# EAGLE design CKR_BM_v4.2_TR (EAGLE 9.5.2)

## Sheet 1 of 3: OTHER_1
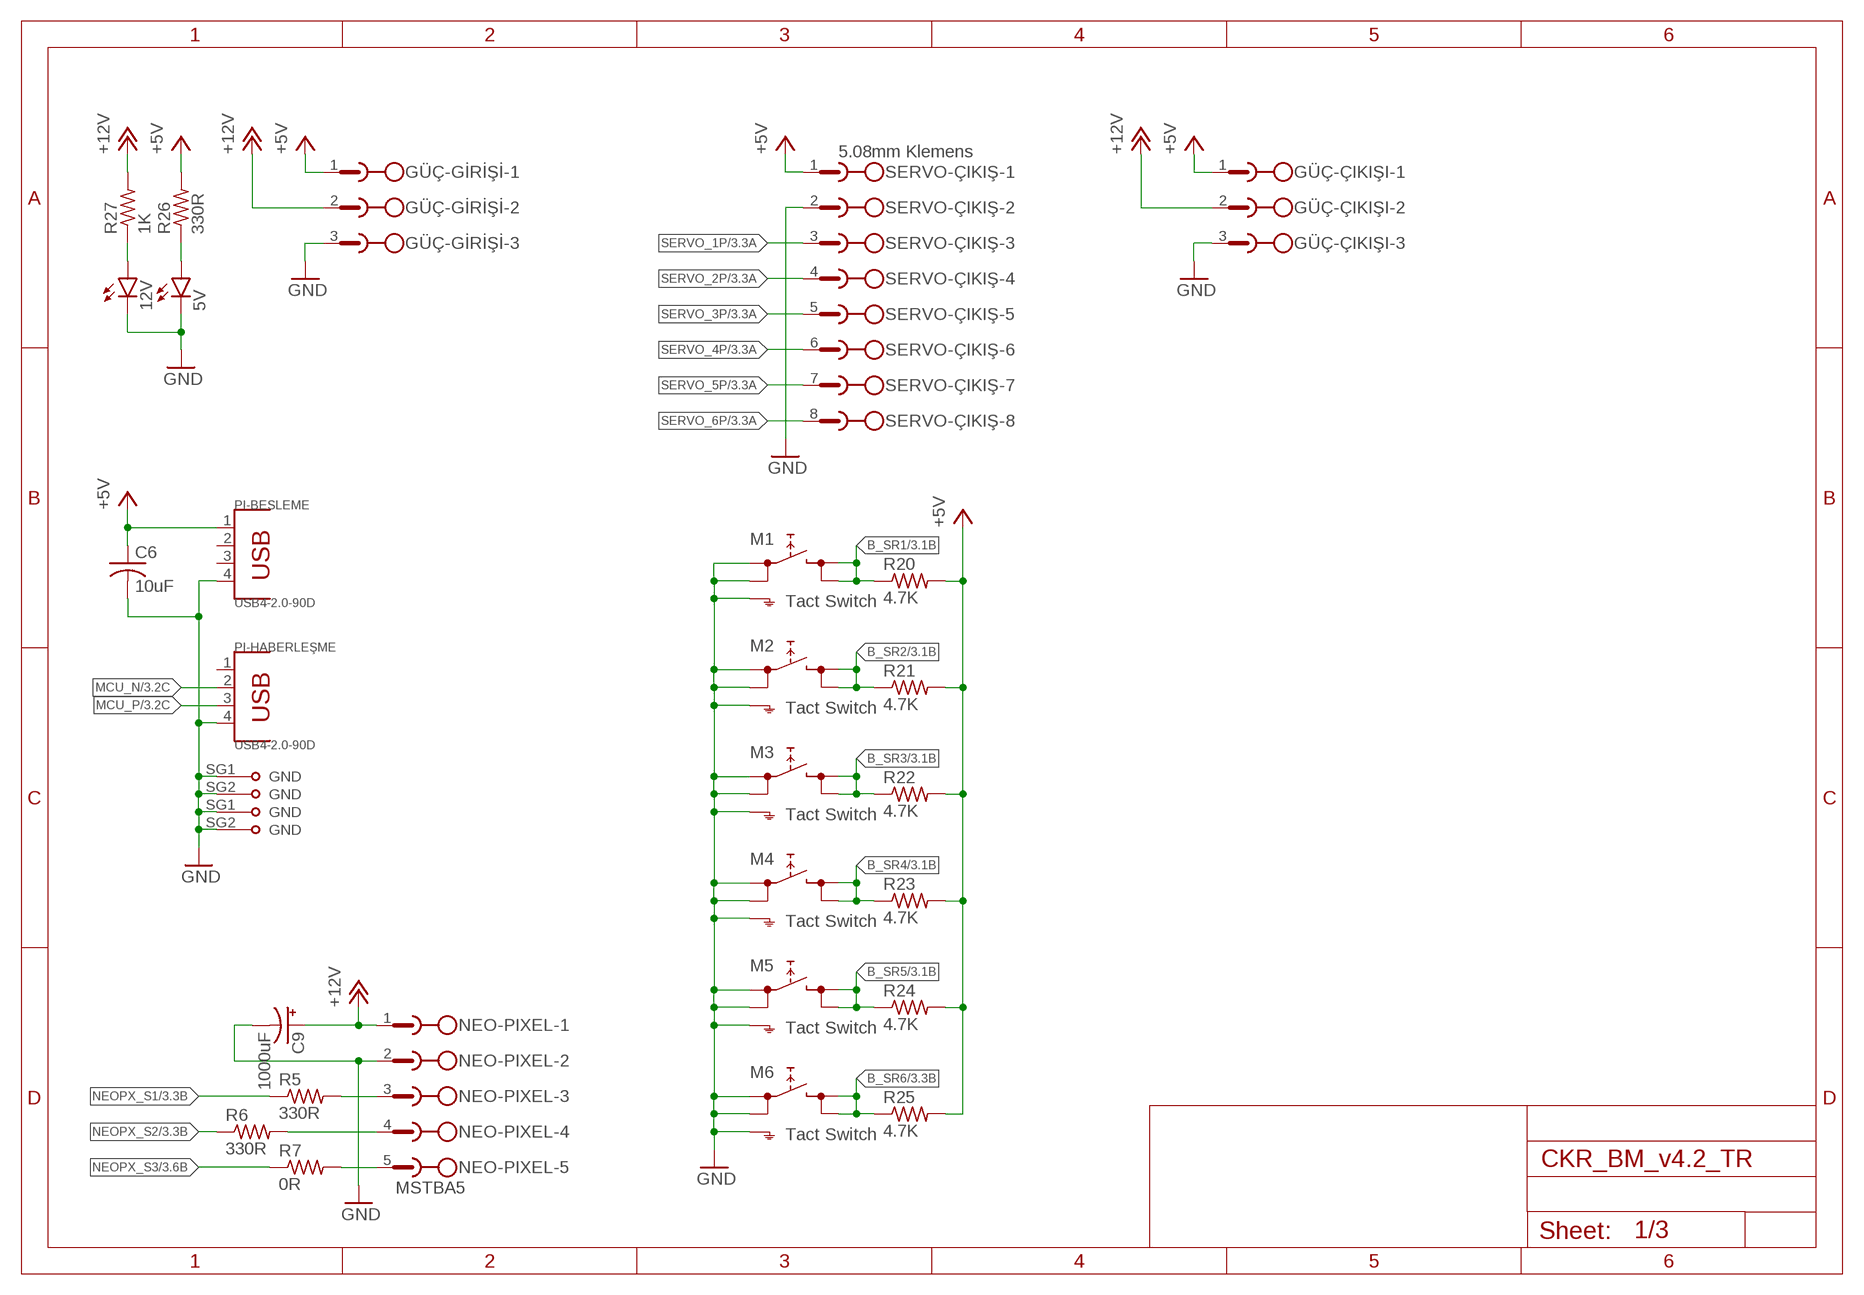
[diagram p0: schematic, sheet 1]

### Parts
5V  LEDCHIP-LED0805  [CHIP-LED0805]
12V  LEDCHIP-LED0805  [CHIP-LED0805]
C6  10uF  C-USC0805  [C0805]
C9  1000uF  CPOL-US140CLH-1010  [140CLH-1010]
GÜÇ-GİRİŞİ  5.08mm Klemens  MSTBA3  [MSTBA3]
GÜÇ-ÇIKIŞI  5.08mm Klemens  MSTBA3  [MSTBA3]
M1  Tact Switch  SKHMPSE010  [SKHMPXE010]
M2  Tact Switch  SKHMPSE010  [SKHMPXE010]
M3  Tact Switch  SKHMPSE010  [SKHMPXE010]
M4  Tact Switch  SKHMPSE010  [SKHMPXE010]
M5  Tact Switch  SKHMPSE010  [SKHMPXE010]
M6  Tact Switch  SKHMPSE010  [SKHMPXE010]
NEO-PIXEL  MSTBA5  [MSTBA5]
PI-BESLEME  USB4-2.0-90D  DIP-USB-A-TYPE-FMAL(4+2P-2.0-90D)  [USB4+2P-2.0-90D]
PI-HABERLEŞME  USB4-2.0-90D  DIP-USB-A-TYPE-FMAL(4+2P-2.0-90D)  [USB4+2P-2.0-90D]
R5  330R  R-US_R0805  [R0805]
R6  330R  R-US_R0805  [R0805]
R7  0R  R-US_R0805  [R0805]
R20  4.7K  R-US_R0805  [R0805]
R21  4.7K  R-US_R0805  [R0805]
R22  4.7K  R-US_R0805  [R0805]
R23  4.7K  R-US_R0805  [R0805]
R24  4.7K  R-US_R0805  [R0805]
R25  4.7K  R-US_R0805  [R0805]
R26  330R  R-US_R0805  [R0805]
R27  1K  R-US_R0805  [R0805]
SERVO-ÇIKIŞ  5.08mm Klemens  MSTBA8  [MSTBA8]

### Nets
+5V: C6.1 GÜÇ-GİRİŞİ.1 GÜÇ-ÇIKIŞI.1 PI-BESLEME.1 R20.2 R21.2 R22.2 R23.2 R24.2 R25.2 R26.2 SERVO-ÇIKIŞ.1 ; also sheet 2,3
+12V: C9.+ GÜÇ-GİRİŞİ.2 GÜÇ-ÇIKIŞI.2 NEO-PIXEL.1 R27.2 ; also sheet 2
B_SR1: M1.3(2.1) M1.4(2.2) R20.1 ; also sheet 3
B_SR2: M2.3(2.1) M2.4(2.2) R21.1 ; also sheet 3
B_SR3: M3.3(2.1) M3.4(2.2) R22.1 ; also sheet 3
B_SR4: M4.3(2.1) M4.4(2.2) R23.1 ; also sheet 3
B_SR5: M5.3(2.1) M5.4(2.2) R24.1 ; also sheet 3
B_SR6: M6.3(2.1) M6.4(2.2) R25.1 ; also sheet 3
GND: 5V.C 12V.C C6.2 C9.- GÜÇ-GİRİŞİ.3 GÜÇ-ÇIKIŞI.3 M1.1(1.1) M1.2(1.2) M1.5(SH) M2.1(1.1) M2.2(1.2) M2.5(SH) M3.1(1.1) M3.2(1.2) M3.5(SH) M4.1(1.1) M4.2(1.2) M4.5(SH) M5.1(1.1) M5.2(1.2) M5.5(SH) M6.1(1.1) M6.2(1.2) M6.5(SH) NEO-PIXEL.2 PI-BESLEME.4 PI-BESLEME.SG1(GND) PI-BESLEME.SG2(GND) PI-HABERLEŞME.4 PI-HABERLEŞME.SG1(GND) PI-HABERLEŞME.SG2(GND) SERVO-ÇIKIŞ.2 ; also sheet 2,3
MCU_N [diff pairs]: PI-HABERLEŞME.2 ; also sheet 3
MCU_P [diff pairs]: PI-HABERLEŞME.3 ; also sheet 3
N$1: NEO-PIXEL.3 R5.2
N$2: NEO-PIXEL.4 R6.2
N$3: NEO-PIXEL.5 R7.2
N$17: 5V.A R26.1
N$19: 12V.A R27.1
NEOPX_S1: R5.1 ; also sheet 3
NEOPX_S2: R6.1 ; also sheet 3
NEOPX_S3: R7.1 ; also sheet 3
SERVO_1P: SERVO-ÇIKIŞ.3 ; also sheet 3
SERVO_2P: SERVO-ÇIKIŞ.4 ; also sheet 3
SERVO_3P: SERVO-ÇIKIŞ.5 ; also sheet 3
SERVO_4P: SERVO-ÇIKIŞ.6 ; also sheet 3
SERVO_5P: SERVO-ÇIKIŞ.7 ; also sheet 3
SERVO_6P: SERVO-ÇIKIŞ.8 ; also sheet 3
Unconnected: PI-BESLEME.2 PI-BESLEME.3 PI-HABERLEŞME.1

## Sheet 2 of 3: OTHER_2
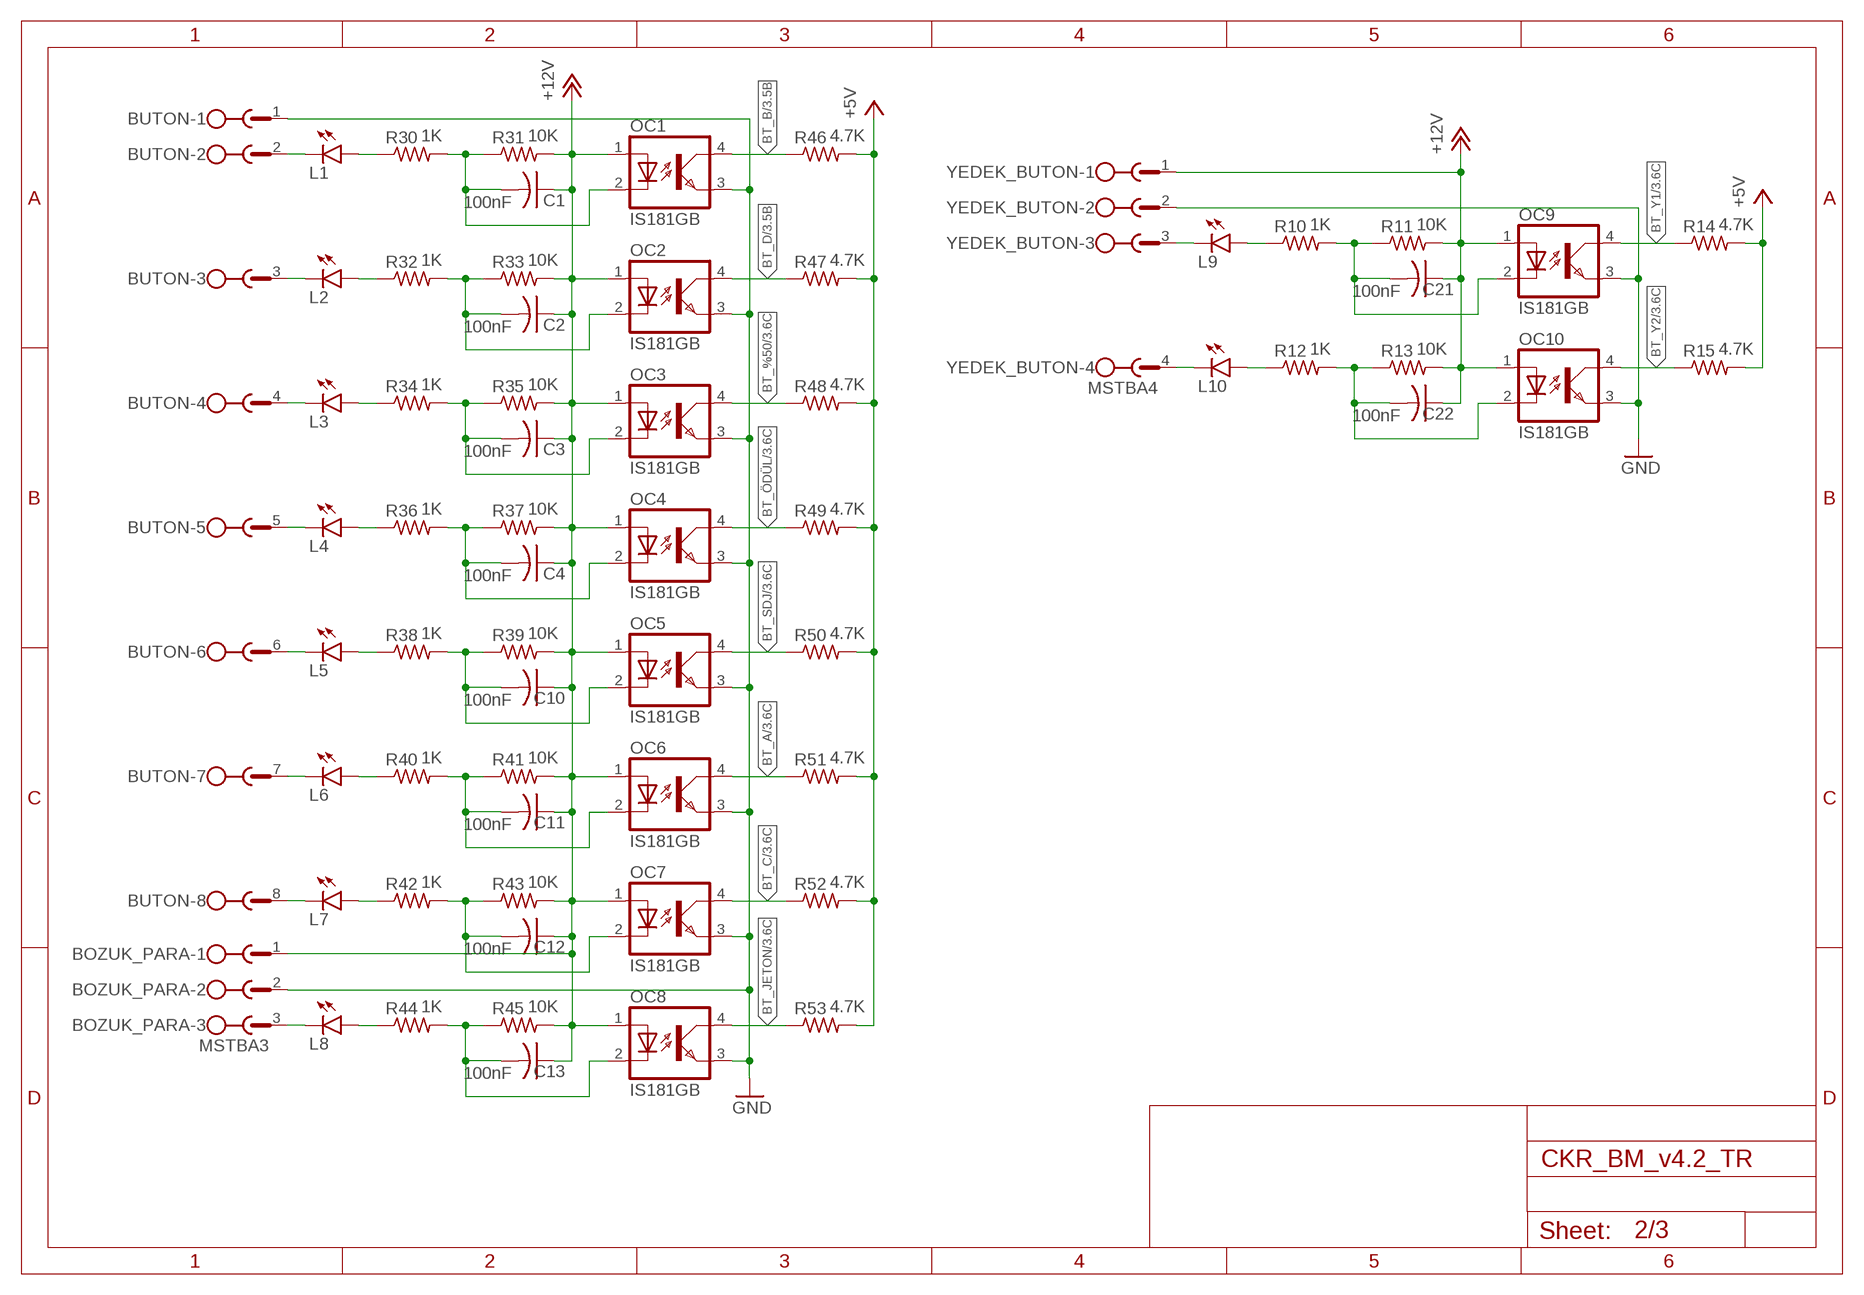
[diagram p1: schematic, sheet 2]

### Parts
BOZUK_PARA  MSTBA3  [MSTBA3]
BUTON  MSTBA8  [MSTBA8]
C1  100nF  C-USC0805  [C0805]
C2  100nF  C-USC0805  [C0805]
C3  100nF  C-USC0805  [C0805]
C4  100nF  C-USC0805  [C0805]
C10  100nF  C-USC0805  [C0805]
C11  100nF  C-USC0805  [C0805]
C12  100nF  C-USC0805  [C0805]
C13  100nF  C-USC0805  [C0805]
C21  100nF  C-USC0805  [C0805]
C22  100nF  C-USC0805  [C0805]
L1  LEDCHIP-LED0805  [CHIP-LED0805]
L2  LEDCHIP-LED0805  [CHIP-LED0805]
L3  LEDCHIP-LED0805  [CHIP-LED0805]
L4  LEDCHIP-LED0805  [CHIP-LED0805]
L5  LEDCHIP-LED0805  [CHIP-LED0805]
L6  LEDCHIP-LED0805  [CHIP-LED0805]
L7  LEDCHIP-LED0805  [CHIP-LED0805]
L8  LEDCHIP-LED0805  [CHIP-LED0805]
L9  LEDCHIP-LED0805  [CHIP-LED0805]
L10  LEDCHIP-LED0805  [CHIP-LED0805]
OC1  IS181GB  TLP181  [SO-4]
OC2  IS181GB  TLP181  [SO-4]
OC3  IS181GB  TLP181  [SO-4]
OC4  IS181GB  TLP181  [SO-4]
OC5  IS181GB  TLP181  [SO-4]
OC6  IS181GB  TLP181  [SO-4]
OC7  IS181GB  TLP181  [SO-4]
OC8  IS181GB  TLP181  [SO-4]
OC9  IS181GB  TLP181  [SO-4]
OC10  IS181GB  TLP181  [SO-4]
R10  1K  R-US_R0805  [R0805]
R11  10K  R-US_R0805  [R0805]
R12  1K  R-US_R0805  [R0805]
R13  10K  R-US_R0805  [R0805]
R14  4.7K  R-US_R0805  [R0805]
R15  4.7K  R-US_R0805  [R0805]
R30  1K  R-US_R0805  [R0805]
R31  10K  R-US_R0805  [R0805]
R32  1K  R-US_R0805  [R0805]
R33  10K  R-US_R0805  [R0805]
R34  1K  R-US_R0805  [R0805]
R35  10K  R-US_R0805  [R0805]
R36  1K  R-US_R0805  [R0805]
R37  10K  R-US_R0805  [R0805]
R38  1K  R-US_R0805  [R0805]
R39  10K  R-US_R0805  [R0805]
R40  1K  R-US_R0805  [R0805]
R41  10K  R-US_R0805  [R0805]
R42  1K  R-US_R0805  [R0805]
R43  10K  R-US_R0805  [R0805]
R44  1K  R-US_R0805  [R0805]
R45  10K  R-US_R0805  [R0805]
R46  4.7K  R-US_R0805  [R0805]
R47  4.7K  R-US_R0805  [R0805]
R48  4.7K  R-US_R0805  [R0805]
R49  4.7K  R-US_R0805  [R0805]
R50  4.7K  R-US_R0805  [R0805]
R51  4.7K  R-US_R0805  [R0805]
R52  4.7K  R-US_R0805  [R0805]
R53  4.7K  R-US_R0805  [R0805]
YEDEK_BUTON  MSTBA4  [MSTBA4]

### Nets
+5V: R14.2 R15.2 R46.2 R47.2 R48.2 R49.2 R50.2 R51.2 R52.2 R53.2 ; also sheet 1,3
+12V: BOZUK_PARA.1 C1.1 C2.1 C3.1 C4.1 C10.1 C11.1 C12.1 C13.1 C21.1 C22.1 OC1.1(A) OC2.1(A) OC3.1(A) OC4.1(A) OC5.1(A) OC6.1(A) OC7.1(A) OC8.1(A) OC9.1(A) OC10.1(A) R11.2 R13.2 R31.2 R33.2 R35.2 R37.2 R39.2 R41.2 R43.2 R45.2 YEDEK_BUTON.1 ; also sheet 1
BT_%50: OC3.4(COL) R48.1 ; also sheet 3
BT_A: OC6.4(COL) R51.1 ; also sheet 3
BT_B: OC1.4(COL) R46.1 ; also sheet 3
BT_C: OC7.4(COL) R52.1 ; also sheet 3
BT_D: OC2.4(COL) R47.1 ; also sheet 3
BT_JETON: OC8.4(COL) R53.1 ; also sheet 3
BT_SDJ: OC5.4(COL) R50.1 ; also sheet 3
BT_Y1: OC9.4(COL) R14.1 ; also sheet 3
BT_Y2: OC10.4(COL) R15.1 ; also sheet 3
BT_ÖDÜL: OC4.4(COL) R49.1 ; also sheet 3
GND: BOZUK_PARA.2 BUTON.1 OC1.3(EMIT) OC2.3(EMIT) OC3.3(EMIT) OC4.3(EMIT) OC5.3(EMIT) OC6.3(EMIT) OC7.3(EMIT) OC8.3(EMIT) OC9.3(EMIT) OC10.3(EMIT) YEDEK_BUTON.2 ; also sheet 1,3
N$4: L1.A R30.1
N$5: C1.2 OC1.2(C) R30.2 R31.1
N$6: L9.A R10.1
N$7: BUTON.2 L1.C
N$11: BOZUK_PARA.3 L8.C
N$12: L2.A R32.1
N$13: C2.2 OC2.2(C) R32.2 R33.1
N$14: C21.2 OC9.2(C) R10.2 R11.1
N$24: BUTON.8 L7.C
N$25: L3.A R34.1
N$26: C3.2 OC3.2(C) R34.2 R35.1
N$27: L9.C YEDEK_BUTON.3
N$28: BUTON.7 L6.C
N$29: L4.A R36.1
N$30: C4.2 OC4.2(C) R36.2 R37.1
N$31: L10.A R12.1
N$32: BUTON.6 L5.C
N$33: L5.A R38.1
N$34: C10.2 OC5.2(C) R38.2 R39.1
N$35: C22.2 OC10.2(C) R12.2 R13.1
N$36: BUTON.5 L4.C
N$37: L6.A R40.1
N$38: C11.2 OC6.2(C) R40.2 R41.1
N$39: L10.C YEDEK_BUTON.4
N$40: BUTON.4 L3.C
N$41: L7.A R42.1
N$42: C12.2 OC7.2(C) R42.2 R43.1
N$44: BUTON.3 L2.C
N$45: L8.A R44.1
N$46: C13.2 OC8.2(C) R44.2 R45.1

## Sheet 3 of 3: IC
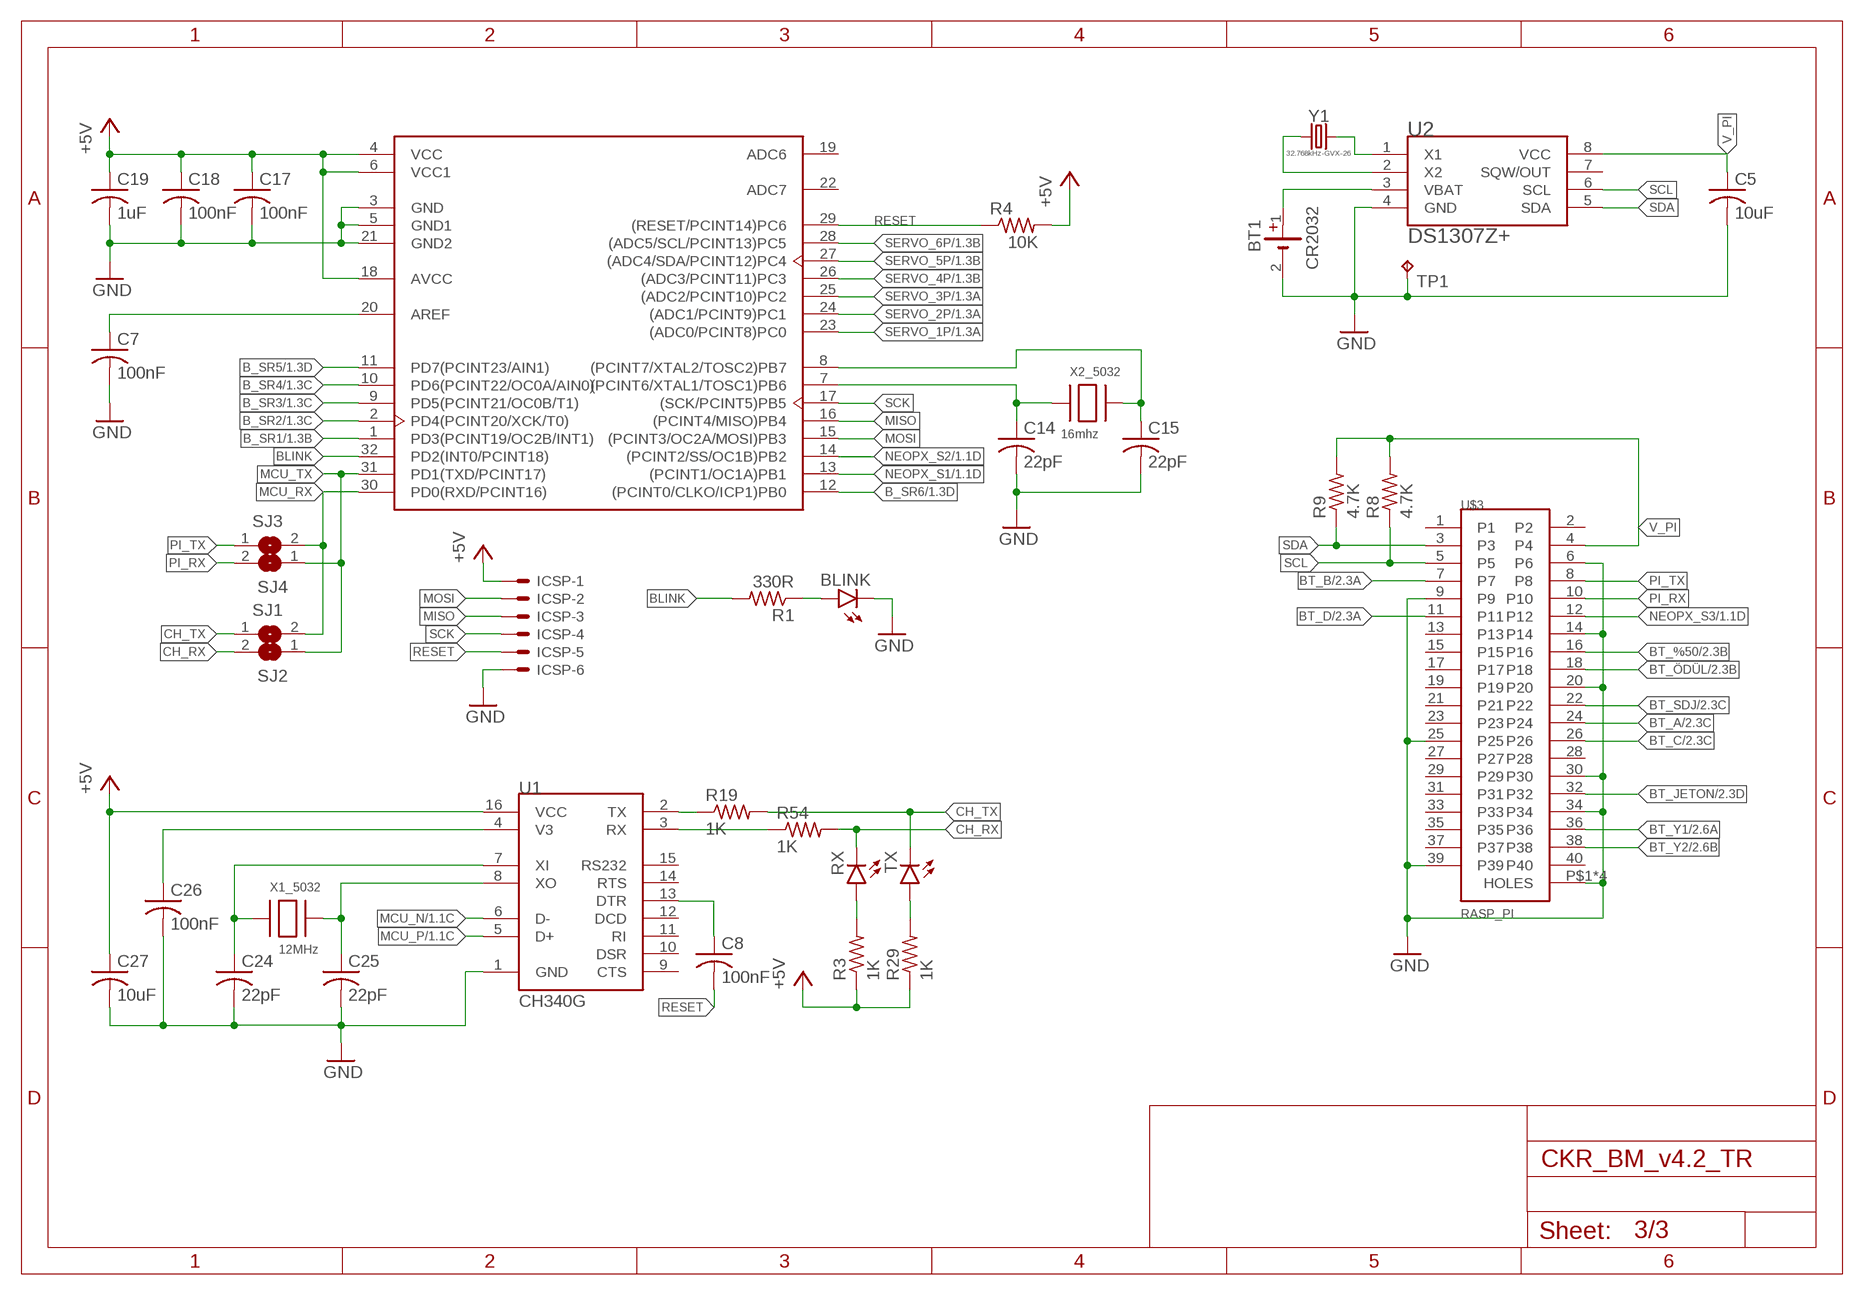
[diagram p2: schematic, sheet 3]

### Parts
BLINK  LEDCHIP-LED0805  [CHIP-LED0805]
BT1  CR2032  79528211  [79528211]
C5  10uF  C-USC0805  [C0805]
C7  100nF  C-USC0805  [C0805]
C8  100nF  C-USC0805  [C0805]
C14  22pF  C-USC0805  [C0805]
C15  22pF  C-USC0805  [C0805]
C17  100nF  C-USC0805  [C0805]
C18  100nF  C-USC0805  [C0805]
C19  1uF  C-USC0805  [C0805]
C24  22pF  C-USC0805  [C0805]
C25  22pF  C-USC0805  [C0805]
C26  100nF  C-USC0805  [C0805]
C27  10uF  C-USC0805  [C0805]
ICSP  C-GRID-06-70543  [70543-06]
R1  330R  R-US_R0805  [R0805]
R3  1K  R-US_R0805  [R0805]
R4  10K  R-US_R0805  [R0805]
R8  4.7K  R-US_R0805  [R0805]
R9  4.7K  R-US_R0805  [R0805]
R19  1K  R-US_R0805  [R0805]
R29  1K  R-US_R0805  [R0805]
R54  1K  R-US_R0805  [R0805]
RX  LEDCHIP-LED0805  [CHIP-LED0805]
SJ1  SJ  [SJ]
SJ2  SJ  [SJ]
SJ3  SJ  [SJ]
SJ4  SJ  [SJ]
TP1  GND  TPTP15R  [TP15R]
TX  LEDCHIP-LED0805  [CHIP-LED0805]
U1  CH340G  [SOIC16]
U2  DS1307Z+  [SOIC-8N]
U4  ATMEGA328P-AU  [TQFP-32]
U$3  RASP_PI  [RASP_PI]
X1_5032  12MHz  XTALNX5032  [NX5032]
X2_5032  16mhz  XTALNX5032  [NX5032]
Y1  32.768kHz-GVX-26  CRYSTAL-32.768KHZPTH-2X6  [CRYSTAL-PTH-2X6-CYL]

### Nets
+5V: C17.1 C18.1 C19.1 C27.1 ICSP.1 R3.1 R4.2 R29.1 U1.16(VCC) U4.4(VCC) U4.6(VCC1) U4.18(AVCC) ; also sheet 1,2
B_SR1: U4.1(PD3(PCINT19/OC2B/INT1)) ; also sheet 1
B_SR2: U4.2(PD4(PCINT20/XCK/T0)) ; also sheet 1
B_SR3: U4.9(PD5(PCINT21/OC0B/T1)) ; also sheet 1
B_SR4: U4.10(PD6(PCINT22/OC0A/AIN0)) ; also sheet 1
B_SR5: U4.11(PD7(PCINT23/AIN1)) ; also sheet 1
B_SR6: U4.12((PCINT0/CLKO/ICP1)PB0) ; also sheet 1
BLINK: R1.2 U4.32(PD2(INT0/PCINT18))
BT_%50: U$3.16 ; also sheet 2
BT_A: U$3.24 ; also sheet 2
BT_B: U$3.7 ; also sheet 2
BT_C: U$3.26 ; also sheet 2
BT_D: U$3.11 ; also sheet 2
BT_JETON: U$3.32 ; also sheet 2
BT_SDJ: U$3.22 ; also sheet 2
BT_Y1: U$3.36 ; also sheet 2
BT_Y2: U$3.38 ; also sheet 2
BT_ÖDÜL: U$3.18 ; also sheet 2
CH_RX: R54.2 RX.C SJ2.2
CH_TX: R19.2 SJ1.1 TX.C
GND: BLINK.C BT1.2(-) C5.2 C7.2 C14.2 C15.2 C17.2 C18.2 C19.2 C24.2 C25.2 C26.2 C27.2 ICSP.6 TP1.TP U1.1(GND) U2.4(GND) U4.3(GND) U4.5(GND1) U4.21(GND2) U$3.6 U$3.9 U$3.14 U$3.20 U$3.25 U$3.30 U$3.34 U$3.39 U$3.P$1(HOLES) U$3.P$2(HOLES) U$3.P$3(HOLES) U$3.P$4(HOLES) ; also sheet 1,2
MCU_N [diff pairs]: U1.6(D-) ; also sheet 1
MCU_P [diff pairs]: U1.5(D+) ; also sheet 1
MCU_RX: SJ1.2 SJ3.2 U4.30(PD0(RXD/PCINT16))
MCU_TX: SJ2.1 SJ4.1 U4.31(PD1(TXD/PCINT17))
MISO: ICSP.3 U4.16((PCINT4/MISO)PB4)
MOSI: ICSP.2 U4.15((PCINT3/OC2A/MOSI)PB3)
N$8: BT1.1(+) U2.3(VBAT)
N$9: U2.2(X2) Y1.1
N$10: U2.1(X1) Y1.2
N$15: R3.2 RX.A
N$16: R29.2 TX.A
N$20: C14.1 U4.7((PCINT6/XTAL1/TOSC1)PB6) X2_5032.P$1
N$21: C8.1 U1.13(DTR)
N$22: C26.1 U1.4(V3)
N$49: C24.1 U1.7(XI) X1_5032.P$1
N$50: C25.1 U1.8(XO) X1_5032.P$2
N$52: R19.1 U1.2(TX)
N$53: R54.1 U1.3(RX)
N$55: BLINK.A R1.1
N$58: C7.1 U4.20(AREF)
N$78: C15.1 U4.8((PCINT7/XTAL2/TOSC2)PB7) X2_5032.P$2
NEOPX_S1: U4.13((PCINT1/OC1A)PB1) ; also sheet 1
NEOPX_S2: U4.14((PCINT2/SS/OC1B)PB2) ; also sheet 1
NEOPX_S3: U$3.12 ; also sheet 1
PI_RX: SJ4.2 U$3.10
PI_TX: SJ3.1 U$3.8
RESET: C8.2 ICSP.5 R4.1 U4.29((RESET/PCINT14)PC6)
SCK: ICSP.4 U4.17((SCK/PCINT5)PB5)
SCL: R8.1 U2.6(SCL) U$3.5
SDA: R9.1 U2.5(SDA) U$3.3
SERVO_1P: U4.23((ADC0/PCINT8)PC0) ; also sheet 1
SERVO_2P: U4.24((ADC1/PCINT9)PC1) ; also sheet 1
SERVO_3P: U4.25((ADC2/PCINT10)PC2) ; also sheet 1
SERVO_4P: U4.26((ADC3/PCINT11)PC3) ; also sheet 1
SERVO_5P: U4.27((ADC4/SDA/PCINT12)PC4) ; also sheet 1
SERVO_6P: U4.28((ADC5/SCL/PCINT13)PC5) ; also sheet 1
V_PI: C5.1 R8.2 R9.2 U2.8(VCC) U$3.4
Unconnected: U1.9(CTS) U1.10(DSR) U1.11(RI) U1.12(DCD) U1.14(RTS) U1.15(RS232) U2.7(SQW/OUT) U4.19(ADC6) U4.22(ADC7) U$3.1 U$3.2 U$3.13 U$3.15 U$3.17 U$3.19 U$3.21 U$3.23 U$3.27 U$3.28 U$3.29 U$3.31 U$3.33 U$3.35 U$3.37 U$3.40

## Library data of the parts
5V 12V BLINK L1-L10 RX TX = led:LED: LED OSRAM: - CHIPLED LG R971, LG N971, LY N971, LG Q971, LY Q971, LO R971, LY R971 LH N974, LH R974 LS Q976, LO Q976, LY Q976 LO Q996 - Hyper CHIPLED LW Q18S LB Q993, LB Q99A, LB R99A - SideLED LS A670, LO A670, LY A670, LG A670, LP A670 LB A673, LV A673, LT A673, LW A673 LH A674 LY A675 LS A676, LA A676, LO A676, LY A676, LW A676 LS A679, LY A679, LG A679 - Hyper Micro SIDELED® LS Y876, LA Y876, LO Y876, LY Y876 LT Y87S - SmartLED LW L88C, LW L88S LB L89C, LB L89S, LG L890 LS L89K, LO L89K, LY L89K LS L896, LA L896, LO L896, LY L896 - TOPLED LS T670, LO T670, LY T670, LG T670, LP T670 LSG T670, LSP T670, LSY T670, LOP T670, LYG T670 LG T671, LOG T671, LSG T671 LB T673, LV T673, LT T673, LW T673 LH T674 LS T676, LA T676, LO T676, LY T676, LB T676, LH T676, LSB T676, LW T676 LB T67C, LV T67C, LT T67C, LS T67K, LO T67K, LY T67K, LW E67C LS E67B, LA E67B, LO E67B, LY E67B, LB E67C, LV E67C, LT E67C LW T67C LS T679, LY T679, LG T679 LS T770, LO T770, LY T770, LG T770, LP T770 LB T773, LV T773, LT T773, LW T773 LH T774 LS E675, LA E675, LY E675, LS T675 LS T776, LA T776, LO T776, LY T776, LB T776 LHGB T686 LT T68C, LB T68C - Hyper Mini TOPLED® LB M676 - Mini TOPLED Santana® LG M470 LS M47K, LO M47K, LY M47K Source: http://www.osram.convergy.de LUXEON: - LUMILED® LXK2-PW12-R00, LXK2-PW12-S00, LXK2-PW14-U00, LXK2-PW14-V00 LXK2-PM12-R00, LXK2-PM12-S00, LXK2-PM14-U00 LXK2-PE12-Q00, LXK2-PE12-R00, LXK2-PE12-S00, LXK2-PE14-T00, LXK2-PE14-U00 LXK2-PB12-K00, LXK2-PB12-L00, LXK2-PB12-M00, LXK2-PB14-N00, LXK2-PB14-P00, LXK2-PB14-Q00 LXK2-PR12-L00, LXK2-PR12-M00, LXK2-PR14-Q00, LXK2-PR14-R00 LXK2-PD12-Q00, LXK2-PD12-R00, LXK2-PD12-S00 LXK2-PH12-R00, LXK2-PH12-S00 LXK2-PL12-P00, LXK2-PL12-Q00, LXK2-PL12-R00 Source: www.luxeon.com KINGBRIGHT: KA-3528ASYC Source: www.kingbright.com
BOZUK_PARA GÜÇ-GİRİŞİ GÜÇ-ÇIKIŞI = con-phoenix-508:MSTBA3: PHOENIX; MF: FARNELL; MPN: 1757255; OC_FARNELL: 3705183; OC_NEWARK: 71C4162
BT1 = Battery Holder:79528211: BATTERY HOLDER COIN 20MM PC PIN Manufacturer's datasheet <https://katalog.we-online.de/em/datasheet/79528211.pdf>; CREATED_BY: PCBLayout.com; DIGIKEY_PART_NO: 732-12326-ND; MANUFACTURER: Wurth Electronics Inc.; MPN: 79528211
BUTON SERVO-ÇIKIŞ = con-phoenix-508:MSTBA8: PHOENIX; MF: FARNELL; MPN: 1757307; OC_FARNELL: 3705225; OC_NEWARK: 71C4166
C1-C8 C10-C15 C17-C19 C21 C22 C24-C27 = rcl:C-US: CAPACITOR, American symbol; SPICEPREFIX: C
C9 = rcl:CPOL-US: POLARIZED CAPACITOR, American symbol; SPICEPREFIX: C
ICSP = con-molex:C-GRID-06: CONNECTOR wire to board 2.54 mm (0.100") pitch header; MF: MOLEX; OC_FARNELL: unknown; OC_NEWARK: unknown
M1-M6 = switch:SKHMP*E010: 6.2 X 6.5mm TACT Switch (SMD) Source: http://www3.alps.co.jp/WebObjects/catalog.woa/PDF/E/Switch/Tact/SKHM/SKHM.PDF
NEO-PIXEL = con-phoenix-508:MSTBA5: PHOENIX; MPN: 1757271; OC_FARNELL: 3705201; OC_NEWARK: 71C4164
OC1-OC10 = optocoupler-2:TLP181
PI-BESLEME PI-HABERLEŞME = Seeed-Connector:DIP-USB-A-TYPE-FMAL(4+2P-2.0-90D): 320010007
R1 R3-R15 R19-R27 R29-R54 = rcl:R-US_: RESISTOR, American symbol; SPICEPREFIX: R
SJ1-SJ4 = jumper:SJ: SMD solder JUMPER
TP1 = testpad:TP: Test pad
U1 = CH340:CH340G
U2 = IC:DS1307Z+: IC RTC CLK/CALENDAR I2C 8-SOIC Manufacturer's datasheet <https://datasheets.maximintegrated.com/en/ds/DS1307.pdf>; CREATED_BY: PCBLayout.com; DIGI-KEY_PART_NUMBER: DS1307Z+-ND; MANUFACTURER: Maxim Integrated; MPN: DS1307Z+; PACKAGE: SOIC-8
U4 = Microcontroller:ATMEGA328P-AU: IC MCU 8BIT 32KB FLASH 32TQFP Manufacturer's datasheet <http://ww1.microchip.com/downloads/en/DeviceDoc/ATmega48A-PA-88A-PA-168A-PA-328-P-DS-DS40002061A.pdf>; CREATED_BY: PCBLayout.com; DIGIKEY_PART_NUMBER: ATMEGA328P-AU-ND; MANUFACTURER: Microchip Technology; MPN: ATMEGA328P-AU; PACKAGE: TQFP-32
U$3 = 1-my-library:RASP_PI
X1_5032 X2_5032 = adafruit:XTAL: Low cost SMT crystals, no capacitors included http://www.ladyada.net/library/eagle
Y1 = SparkFun-Clocks:CRYSTAL-32.768KHZ: 32.768kHz Crystal Frequency: 32.768kHz Frequency Stability: ±20ppm Load Capacitance: 12.5pF (PTH-2X6 & SMD-3.2X1.5), 6pF (SMD-2X6) SparkFun Products: SparkFun BigTime Watch Kit <https://www.sparkfun.com/products/11734> SparkFun nRF52832 Breakout <https://www.sparkfun.com/products/13990> SparkFun Real Time Clock Module <https://www.sparkfun.com/products/12708>; PROD_ID: XTAL-10112; VALUE: 32.768kHz
YEDEK_BUTON = con-phoenix-508:MSTBA4: PHOENIX; MF: FARNELL; MPN: 1757268; OC_FARNELL: 3705195; OC_NEWARK: 71C4163

## Net classes
1 diff pairs: width 0.254 mm

## Board
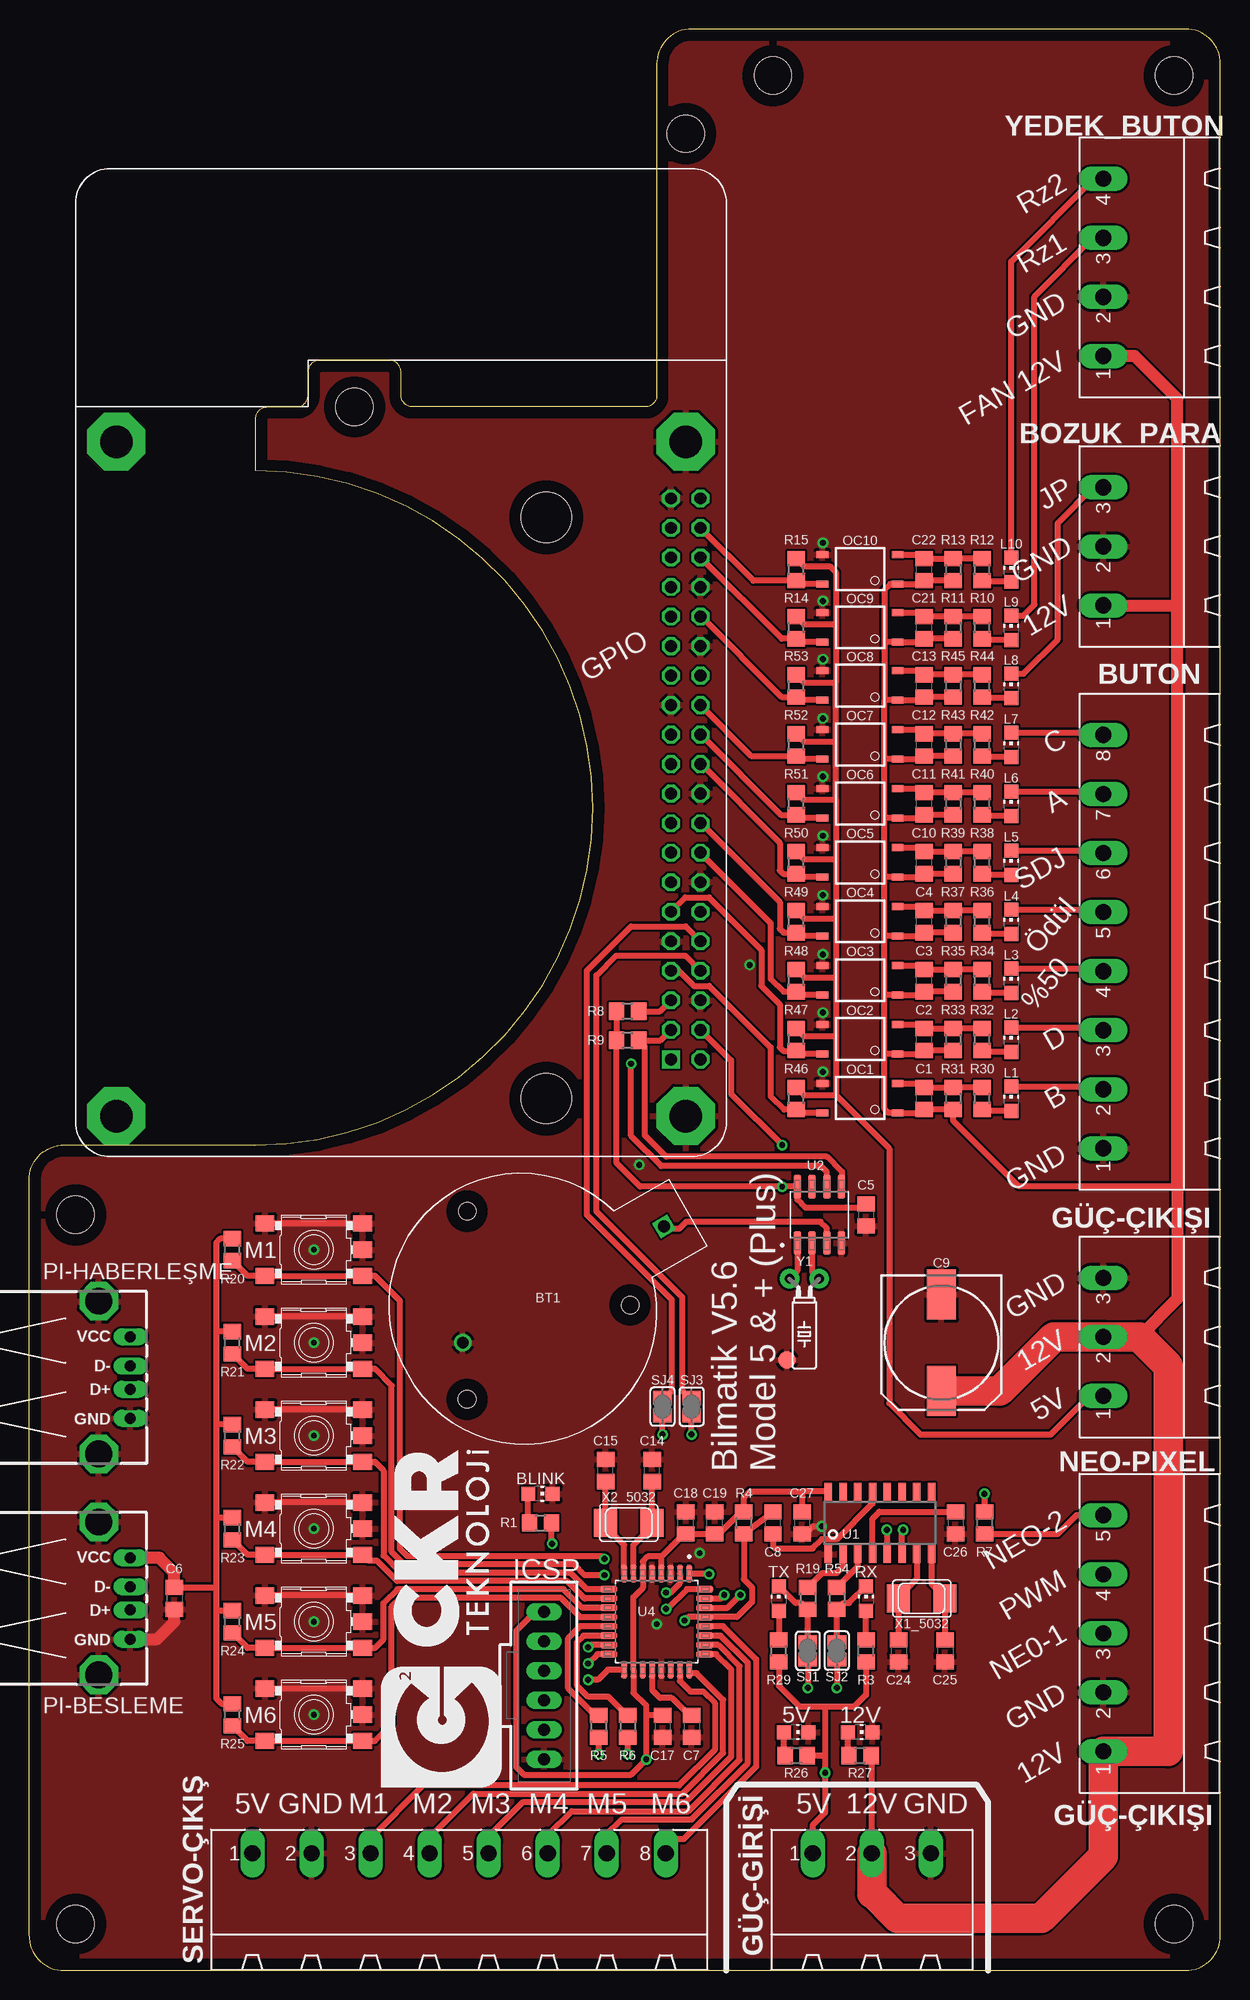
[diagram p3: board, top side]
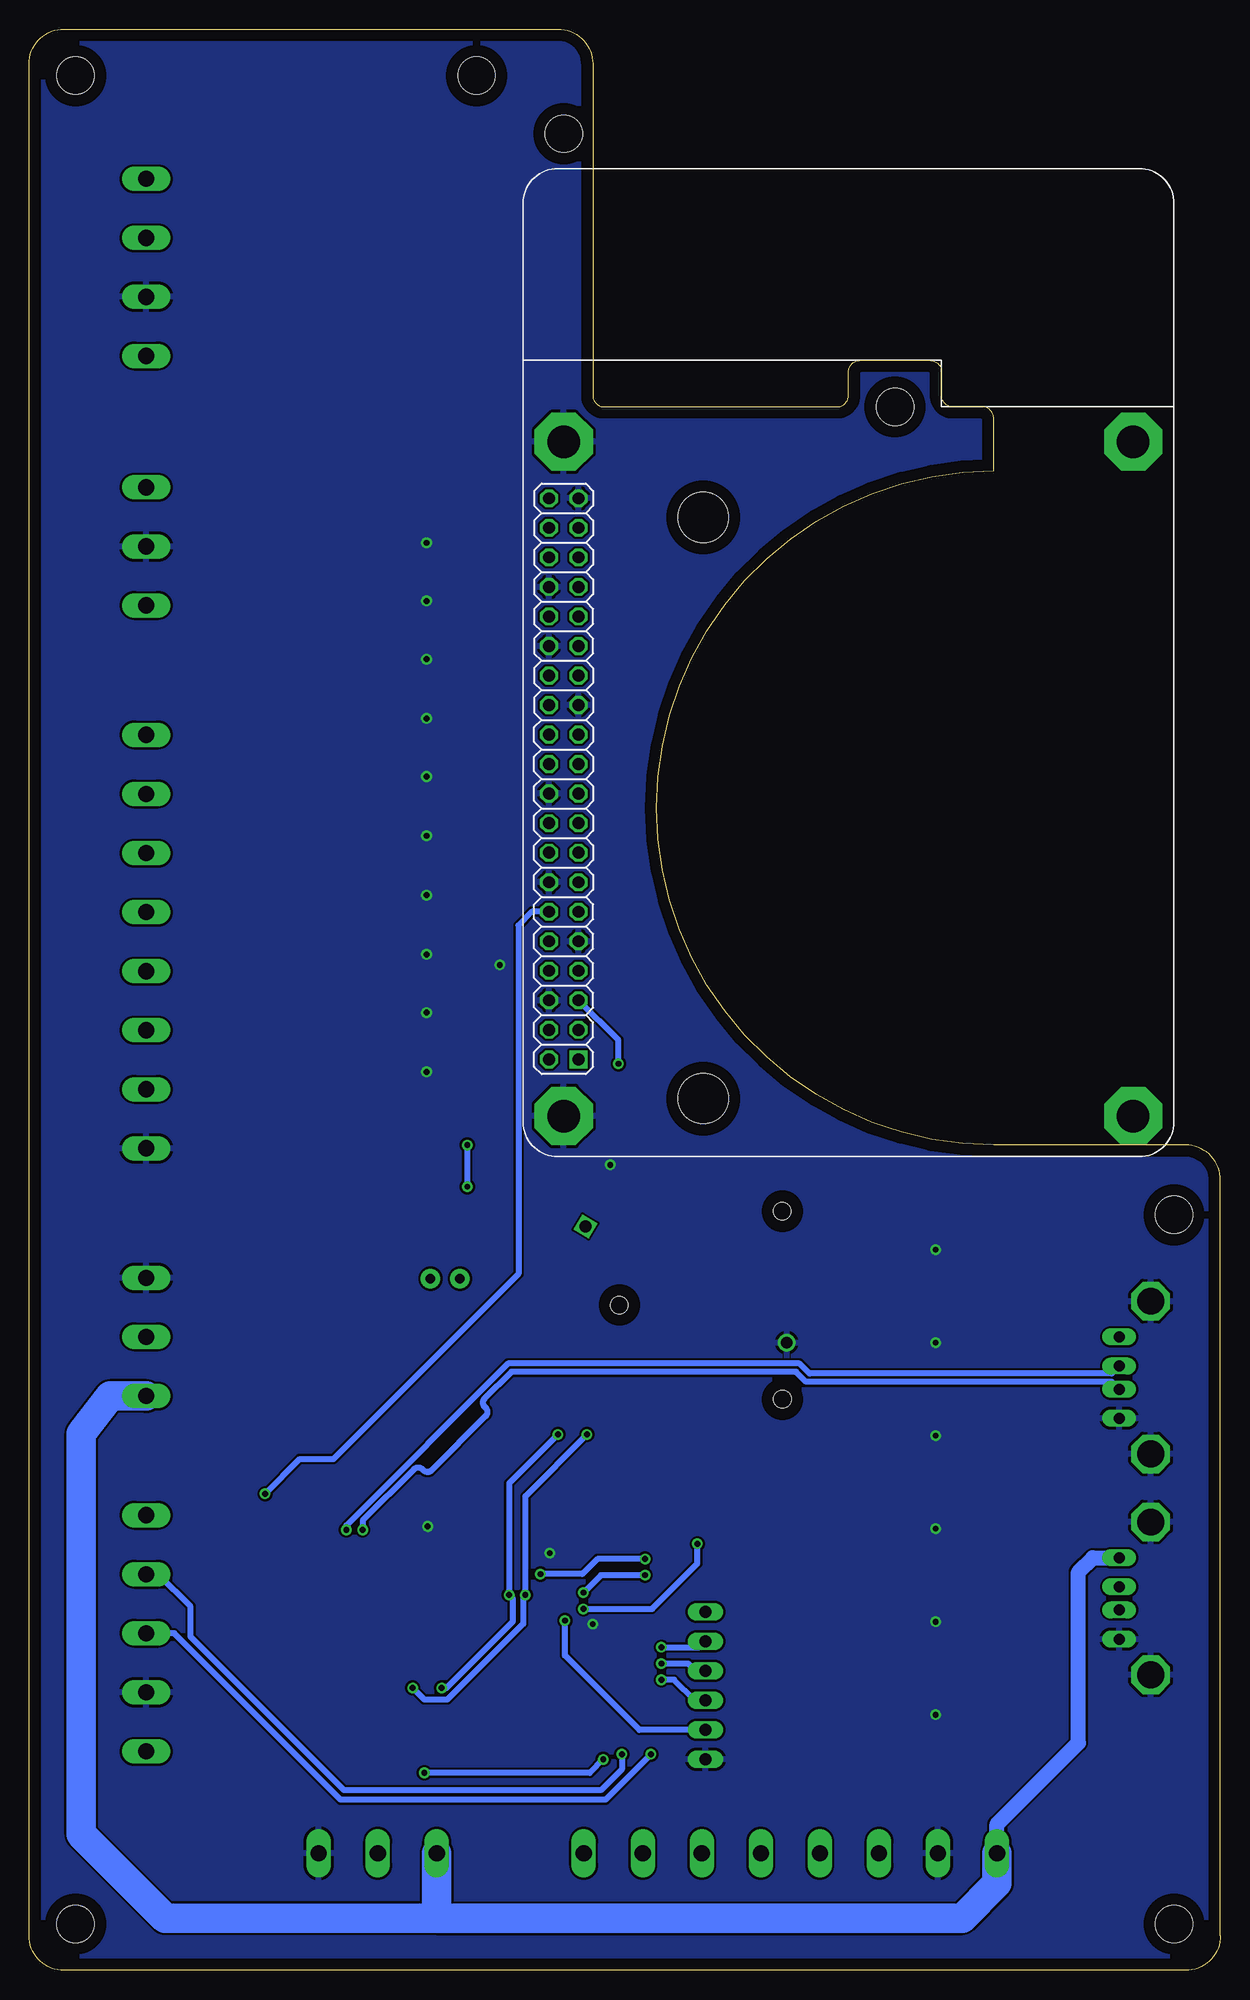
[diagram p4: board, bottom side, seen from below]

Size 102.5 x 167 mm. Coordinates in mm from the lower left corner, seen from the top.
Outline: 3,0 99.5,0 arc90 102.5,3 102.5,164 arc90 99.5,167 57,167 arc90 54,164 54,135.5 arc-90 53,134.5 33,134.5 arc-90 32,135.5 32,137.5 arc90 31,138.5 25,138.5 arc90 24,137.5 24,135.5 arc-90 23,134.5 20.5,134.5 arc90 19.5,133.5 19.5,129 arc-90 48.5,100 arc-90 19.5,71 3,71 arc90 0,68 0,3 arc90 3,0
Copper layers (1*16): Top 0.035mm / dielectric 1.5mm / Bottom 0.035mm
Design rules "default *": minimum track width 20mil, minimum drill 0.5mm, track to track 0.2mm, track to pad 0.2mm, pad to pad 0.2mm, via to via 0.2mm, smd to smd 0.2mm, copper to edge 40mil, drill to drill 0.9mm, minimum pad ring 10mil, minimum via ring 8mil, stop-mask expansion 4mil, vias tented up to drill 0mil, thermal gap 10mil
Holes 3.2 mm at 98.5,163 4,4 98.5,4 28,134.5 4,65 64,163 56.5,158
Holes 4.3 mm at 44.5,75 44.5,125

### Footprints (pad centres in the part's own frame; a part is rotated, then mirrored left to right if it is on the bottom)
CHIP-LED0805 = smd 1.2 x 1.2: A 0,-1.05; C 0,1.05
MSTBA3 = drill 1.397 long: 1 -5.08,5.08; 2 0,5.08; 3 5.08,5.08
79528211 = drill 1 square: 1 -14,0 | drill 1: 2 6,0 | hole 1.5: -8.1,4.4; 8.1,4.4; 0,-9.6
MSTBA8 = drill 1.397 long: 1 -17.78,5.08; 2 -12.7,5.08; 3 -7.62,5.08; 4 -2.54,5.08; 5 2.54,5.08; 6 7.62,5.08; 7 12.7,5.08; 8 17.78,5.08
C0805 = smd 1.3 x 1.5: 1 -0.95,0; 2 0.95,0
140CLH-1010 = smd 4.3 x 2.5: + 4.15,0; - -4.15,0
70543-06 = drill 1.016 long: 1 -6.35,0; 2 -3.81,0; 3 -1.27,0; 4 1.27,0; 5 3.81,0; 6 6.35,0
SKHMPXE010 = smd 1.6 x 1.4: 1 -4.2,2.25; 2 4.2,2.25; 3 -4.2,-2.25; 4 4.2,-2.25; 5 4.2,0
MSTBA5 = drill 1.397 long: 1 -10.16,5.08; 2 -5.08,5.08; 3 0,5.08; 4 5.08,5.08; 5 10.16,5.08
SO-4 = smd 1 x 0.6: 1 -3.24,0.635; 2 -3.24,-1.905; 3 3.24,-1.905; 4 3.24,0.635
USB4+2P-2.0-90D = drill 0.95 long: 1 -3.5,2.71; 2 -1,2.71; 3 1,2.71; 4 3.5,2.71 | drill 2.3 octagon: SG1 -6.57,0; SG2 6.57,0
R0805 = smd 1.3 x 1.5: 1 -0.95,0; 2 0.95,0
SJ = smd 1.168 x 1.6: 1 -0.762,0; 2 0.762,0
TP15R = smd 1.5 x 1.5: TP 0,0
SOIC16 = smd 0.635 x 1.524: 1 -4.445,-2.695; 2 -3.175,-2.695; 3 -1.905,-2.695; 4 -0.635,-2.695; 5 0.635,-2.695; 6 1.905,-2.695; 7 3.175,-2.695; 8 4.445,-2.695; 9 4.445,2.695; 10 3.175,2.695; 11 1.905,2.695; 12 0.635,2.695; 13 -0.635,2.695; 14 -1.905,2.695; 15 -3.175,2.695; 16 -4.445,2.695
SOIC-8N = smd 0.65 x 2.07: 1 -1.905,-2.425; 2 -0.635,-2.425; 3 0.635,-2.425; 4 1.905,-2.425; 5 1.905,2.425; 6 0.635,2.425; 7 -0.635,2.425; 8 -1.905,2.425
TQFP-32 = smd 0.57 x 1.5: 1 -2.8,-4.13; 2 -2,-4.13; 3 -1.2,-4.13; 4 -0.4,-4.13; 5 0.4,-4.13; 6 1.2,-4.13; 7 2,-4.13; 8 2.8,-4.13; 17 2.8,4.13; 18 2,4.13; 19 1.2,4.13; 20 0.4,4.13; 21 -0.4,4.13; 22 -1.2,4.13; 23 -2,4.13; 24 -2.8,4.13 | smd 1.5 x 0.57: 9 4.13,-2.8; 10 4.13,-2; 11 4.13,-1.2; 12 4.13,-0.4; 13 4.13,0.4; 14 4.13,1.2; 15 4.13,2; 16 4.13,2.8; 25 -4.13,2.8; 26 -4.13,2; 27 -4.13,1.2; 28 -4.13,0.4; 29 -4.13,-0.4; 30 -4.13,-1.2; 31 -4.13,-2; 32 -4.13,-2.8
RASP_PI = drill 1.016 square: 1 8.37,51.23 | drill 1.016 octagon: 2 8.37,53.77; 3 10.91,51.23; 4 10.91,53.77; 5 13.45,51.23; 6 13.45,53.77; 7 15.99,51.23; 8 15.99,53.77; 9 18.53,51.23; 10 18.53,53.77; 11 21.07,51.23; 12 21.07,53.77; 13 23.61,51.23; 14 23.61,53.77; 15 26.15,51.23; 16 26.15,53.77; 17 28.69,51.23; 18 28.69,53.77; 19 31.23,51.23; 20 31.23,53.77; 21 33.77,51.23; 22 33.77,53.77; 23 36.31,51.23; 24 36.31,53.77; 25 38.85,51.23; 26 38.85,53.77; 27 41.39,51.23; 28 41.39,53.77; 29 43.93,51.23; 30 43.93,53.77; 31 46.47,51.23; 32 46.47,53.77; 33 49.01,51.23; 34 49.01,53.77; 35 51.55,51.23; 36 51.55,53.77; 37 54.09,51.23; 38 54.09,53.77; 39 56.63,51.23; 40 56.63,53.77 | drill 2.8 pad 5 octagon: P$1 3.5,3.5; P$2 3.5,52.5; P$3 61.5,52.5; P$4 61.5,3.5
NX5032 = smd 2 x 2.4: P$1 2,0; P$2 -2,0
CRYSTAL-PTH-2X6-CYL = drill 0.813 pad 1.676: 1 -1.27,0; 2 1.27,0
MSTBA4 = drill 1.397 long: 1 -7.62,5.08; 2 -2.54,5.08; 3 2.54,5.08; 4 7.62,5.08

### Placement (x,y rotation side)
5V  66,20.5 270 top
12V  71.5,20.5 270 top
BLINK  44,41 270 top
BOZUK_PARA  97.5,122.5 90 top
BT1  42.5,57 210 top
BUTON  97.5,88.5 90 top
C1  77,75 90 top
C2  77,80.07 90 top
C3  77,85.14 90 top
C4  77,90.21 90 top
C5  72,65 270 top
C6  12.5,32 270 top
C7  57,21 270 top
C8  64,38.5 90 top
C9  78.5,54 270 top
C10  77,95.29 90 top
C11  77,100.36 90 top
C12  77,105.43 90 top
C13  77,110.5 90 top
C14  53.6,43 90 top
C15  49.6,43 90 top
C17  54.5,21 270 top
C18  56.5,38.5 90 top
C19  59,38.5 90 top
C21  77,115.5 90 top
C22  77,120.5 90 top
C24  74.8,27.5 270 top
C25  78.8,27.5 270 top
C26  79.7,38.5 270 top
C27  66.5,38.5 270 top
GÜÇ-GİRİŞİ  72.5,5 0 top
GÜÇ-ÇIKIŞI  97.5,54.5 90 top
ICSP  44.3,24.5 270 top
L1  84.5,75 0 top
L2  84.5,80.07 0 top
L3  84.5,85.14 0 top
L4  84.5,90.21 0 top
L5  84.5,95.29 0 top
L6  84.5,100.36 0 top
L7  84.5,105.43 0 top
L8  84.5,110.5 0 top
L9  84.5,115.5 0 top
L10  84.5,120.5 0 top
M1  24.5,62 0 top
M2  24.5,54 0 top
M3  24.5,46 0 top
M4  24.5,38 0 top
M5  24.5,30 0 top
M6  24.5,22 0 top
NEO-PIXEL  97.5,29 90 top
OC1  71.5,74.4 180 top
OC2  71.5,79.47 180 top
OC3  71.5,84.54 180 top
OC4  71.5,89.61 180 top
OC5  71.5,94.69 180 top
OC6  71.5,99.76 180 top
OC7  71.5,104.83 180 top
OC8  71.5,109.9 180 top
OC9  71.5,114.9 180 top
OC10  71.5,119.9 180 top
PI-BESLEME  6,32 270 top
PI-HABERLEŞME  6,51 270 top
R1  44,38.5 0 top
R3  72,27.5 90 top
R4  61.5,38.5 90 top
R5  49,21 270 top
R6  51.5,21 270 top
R7  82.2,38.5 270 top
R8  51.5,82.5 180 top
R9  51.5,80 180 top
R10  82,115.5 90 top
R11  79.5,115.5 270 top
R12  82,120.5 90 top
R13  79.5,120.5 270 top
R14  66,115.5 90 top
R15  66,120.5 90 top
R19  67,32 270 top
R20  17.5,62 90 top
R21  17.5,54 90 top
R22  17.5,46 90 top
R23  17.5,38 90 top
R24  17.5,30 90 top
R25  17.5,22 90 top
R26  66,18.5 0 top
R27  71.5,18.5 0 top
R29  64.5,27.5 90 top
R30  82,75 90 top
R31  79.5,75 270 top
R32  82,80.07 90 top
R33  79.5,80.07 270 top
R34  82,85.14 90 top
R35  79.5,85.14 270 top
R36  82,90.21 90 top
R37  79.5,90.21 270 top
R38  82,95.29 90 top
R39  79.5,95.29 270 top
R40  82,100.36 90 top
R41  79.5,100.36 270 top
R42  82,105.43 90 top
R43  79.5,105.43 270 top
R44  82,110.5 90 top
R45  79.5,110.5 270 top
R46  66,75 90 top
R47  66,80.07 90 top
R48  66,85.14 90 top
R49  66,90.21 90 top
R50  66,95.29 90 top
R51  66,100.36 90 top
R52  66,105.43 90 top
R53  66,110.5 90 top
R54  69.5,32 270 top
RX  72,32 0 top
SERVO-ÇIKIŞ  37,5 0 top
SJ1  67,27.5 270 top
SJ2  69.5,27.5 90 top
SJ3  57,48.5 270 top
SJ4  54.5,48.5 90 top
TP1  65.2,52.5 180 top
TX  64.5,32 0 top
U1  73.2,38.5 0 top
U2  68,65 0 top
U4  54,30 180 top
U$3  4,70 90 bottom
X1_5032  76.8,32 180 top
X2_5032  51.6,38.5 0 top
Y1  66.7,59.5 180 top
YEDEK_BUTON  97.5,146.5 90 top

### Tracks (layer width: path | path; a pad name or v marks a point on that pad's centre or on a via)
+5V  (via drill 0.5)
  Top 0.508: R14.2 66.65,115.8 69.4,115.8 | 69.4,115.8 69.4,120.3 68.9,120.8 66.65,120.8 R15.2 | 69.4,115.8 69.4,110.8 | 69.4,100.7 69.4,105.7 | 69.4,100.7 69.4,95.6 | 69.4,95.6 69.4,90.5 | 69.4,90.5 69.4,85.4 | 69.4,85.4 69.4,80.4 | 69.4,80.4 69.4,75.3 | R46.2 66.65,75.3 69.4,75.3 | R47.2 66.62,80.4 69.4,80.4 | R48.2 66.69,85.4 69.4,85.4 | R49.2 66.66,90.5 69.4,90.5 | R50.2 66.64,95.6 69.4,95.6 | R51.2 66.61,100.7 69.4,100.7 | R52.2 66.68,105.7 69.4,105.7 | R53.2 66.65,110.8 69.4,110.8 | R20.2 16.45,62.95 16.1,62.6 16.1,55 | R25.2 16.55,22.95 16.1,23.4 16.1,31 | 16.1,55 16.1,47 | 16.1,47 16.1,39 | 16.1,39 16.1,33 | 16.1,33 16.1,31 | R24.2 16.15,30.95 16.1,31 | C6.1 16.05,32.95 16.1,33 | R23.2 16.15,38.95 16.1,39 | R22.2 16.15,46.95 16.1,47 | R21.2 16.15,54.95 16.1,55 | R26.2 68.5,18.5 | GÜÇ-GİRİŞİ.1 67.42,12.52 68.5,13.6 v68.5,17 68.5,18.5 | 69.4,75.3 74,70.7 74,48.8 76.7,46.1 87.9,46.1 91.22,49.42 GÜÇ-ÇIKIŞI.1 | U4.4 54.4,35.6 | 54.4,35.6 56.35,37.55 C18.1 C19.1 59.35,37.55 61.25,39.45 R4.2 61.5,40.7 61.99,41.2 66.5,41.2 | 66.5,41.2 C27.1 | U1.16 66.5,41.2 | R3.1 72,23.7 71,22.7 68.5,22.7 | R29.1 64.5,24.5 66.3,22.7 68.5,22.7 | 69.4,105.7 69.4,110.8 | 68.5,18.5 68.5,22.7 | C17.1 53.1,21.95 | 53.1,21.95 v53.1,18.15 51.78,16.83 42.57,16.83 41.9,17.5 41.9,29.2 43.55,30.85 ICSP.1 | 54.4,35.6 53.22,35.6 52.8,35.18 U4.6 52.8,32.9 52,32.1 U4.18 52,23.9 53.1,22.8 53.1,21.95
  Top 1.016: C6.1 12.5,34.2 11.2,35.5 PI-BESLEME.1
  Bottom 0.508: v53.1,18.15 54.25,17 v68.5,17
  Bottom 1.27: SERVO-ÇIKIŞ.1 19.22,12.58 12.22,19.58 12.22,34.28 11,35.5 PI-BESLEME.1
  Bottom 2.54: GÜÇ-GİRİŞİ.1 67.42,4.5 | SERVO-ÇIKIŞ.1 19.22,7.5 22.22,4.5 67.42,4.5 | 67.42,4.5 90.8,4.5 98,11.7 98,46.2 95.52,49.42 GÜÇ-ÇIKIŞI.1
+12V
  Top 0.508: R45.2 C13.1 76.72,109.27 OC8.1 73.6,109.27 | R43.2 C12.1 76.72,104.19 OC7.1 73.61,104.19 73.6,104.2 | R41.2 C11.1 76.72,99.12 OC6.1 73.62,99.12 73.6,99.1 | R39.2 77.1,94.34 | 77.1,94.34 C10.1 | 77.1,94.34 76.81,94.05 OC5.1 73.65,94.05 73.6,94 | R37.2 C4.1 76.72,88.98 OC4.1 73.62,88.98 73.6,89 | R35.2 C3.1 76.72,83.91 OC3.1 73.61,83.91 73.6,83.9 | R33.2 77.2,79.12 | 77.2,79.12 C2.1 | 77.2,79.12 76.92,78.84 OC2.1 73.64,78.84 73.6,78.8 | R13.2 C22.1 76.72,119.27 OC10.1 74.1,119.27 73.6,118.77 73.6,114.27 | 73.6,78.8 73.6,74.1 73.94,73.77 OC1.1 76.72,73.77 C1.1 R31.2 79.5,73.1 85.1,67.5 98.7,67.5 98.8,67.4 | 73.6,78.8 73.6,83.9 | 73.6,83.9 73.6,89 | 73.6,89 73.6,94 | 73.6,94 73.6,99.1 | 73.6,99.1 73.6,104.2 | 73.6,114.27 OC9.1 76.72,114.27 C21.1 R11.2 | GÜÇ-GİRİŞİ.2 72.45,10.25 R27.2 | 73.6,114.27 73.6,109.27 | 73.6,104.2 73.6,109.27
  Top 1.016: 98.8,117.5 98.8,67.4 98.8,57.8 95.5,54.5 | 98.8,117.5 98.8,135.2 95.12,138.88 YEDEK_BUTON.1 | BOZUK_PARA.1 98.72,117.42 98.8,117.5
  Top 2.54: GÜÇ-GİRİŞİ.2 72.5,6.61 72.54,6.66 74.7,4.5 87.1,4.5 92.42,9.82 NEO-PIXEL.1 98,18.84 98,52 95.5,54.5 GÜÇ-ÇIKIŞI.2 88.15,54.5 83.5,49.85 C9.+
B_SR1  (via drill 0.5)
  Top 0.508: R20.1 18.8,59.75 M1.3 M1.4 29.75,59.75 31.92,57.58 31.92,36.28 32.56,35.63 49.27,35.63 v49.5,35.4 | v58.5,34.1 58.47,34.13 U4.1
  Bottom 0.508: v49.5,35.4 53.6,35.4 54.9,34.1 v58.5,34.1
B_SR2  (via drill 0.5)
  Top 0.508: R21.1 18.8,51.75 M2.3 M2.4 29.75,51.75 31.21,50.29 31.21,35.99 32.27,34.92 46.88,34.92 47.8,34 v49.5,34 | v54.8,32.5 55.2,32.5 56,33.3 U4.2
  Bottom 0.508: v49.5,34 53.3,34 v54.8,32.5
B_SR3
  Top 0.508: R22.1 18.8,43.75 M3.3 M3.4 29.75,43.75 30.5,43 30.5,35.69 31.98,34.22 46.59,34.22 48,32.8 U4.9
B_SR4
  Top 0.508: R23.1 18.8,35.75 M4.3 M4.4 29.2,35.25 29.94,35.25 31.68,33.51 46.29,33.51 47.8,32 U4.10
B_SR5
  Top 0.508: R24.1 18.8,27.75 M5.3 M5.4 29.75,27.75 30.5,28.5 30.5,31.6 31.7,32.8 46,32.8 47.6,31.2 U4.11
B_SR6
  Top 0.508: R25.1 18.8,19.75 M6.3 M6.4 29.75,19.75 31.21,21.21 31.21,31.31 31.99,32.09 45.71,32.09 47.4,30.4 U4.12
BLINK  (via drill 0.5)
  Top 0.508: v54.8,31.1 54.9,31.1 56.6,32.8 U4.32 | v45,36.7 44.95,36.75 R1.2
  Bottom 0.508: v54.8,31.1 48.9,31.1 45,35 v45,36.7
BT_%50
  Top 0.508: OC3.4 66.28,83.91 R48.1 64.91,84.19 63.8,85.3 63.8,90.1 57.77,96.13 U$3.16
BT_A
  Top 0.508: OC6.4 66.28,99.12 R51.1 64.7,99.41 57.8,106.31 U$3.24
BT_B
  Top 0.508: OC1.4 66.28,73.77 R46.1 64.95,74.05 63.8,75.2 63.8,79.4 58.5,84.7 57.2,84.7 55.91,85.99 U$3.7
BT_C
  Top 0.508: OC7.4 66.28,104.19 R52.1 62.12,104.48 57.77,108.83 U$3.26
BT_D
  Top 0.508: OC2.4 66.28,78.84 R47.1 65.98,79.1 64.9,79.1 64.6,79.4 64.6,83.1 63,84.7 63,87.8 58.5,92.3 56.46,92.3 U$3.11
BT_JETON
  Top 0.508: OC8.4 66.28,109.27 R53.1 64.75,109.55 57.83,116.47 U$3.32
BT_SDJ
  Top 0.508: OC5.4 66.28,94.05 R50.1 64.9,94.34 64.6,94.64 64.6,97 57.83,103.77 U$3.22
BT_Y1
  Top 0.508: OC9.4 66.28,114.27 R14.1 64.77,114.55 U$3.36
BT_Y2
  Top 0.508: OC10.4 66.28,119.27 R15.1 62.31,119.55 U$3.38
BT_ÖDÜL
  Top 0.508: OC4.4 66.28,88.98 R49.1 64.94,89.26 64.6,89.6 64.6,91.9 57.81,98.69 U$3.18
CH_RX
  Top 0.508: SJ2.2 R54.2 70.05,31.6 70.55,31.6 RX.C
CH_TX
  Top 0.508: SJ1.1 R19.2 66.45,31.6 65.95,31.6 TX.C
GND  (via drill 0.5)
  Top 0.508: M6.1 M6.2 | M5.2 M5.1 | M4.2 M4.1 | M3.2 M3.1 | M2.2 M2.1 | M1.2 M1.1 | C27.2 66.8,37.55 67.45,38.2 v68.2,38.2
  Top 1.016: PI-BESLEME.4 11,28.5 12.5,30 C6.2
  other vias: 52.5,69.3 68.3,77.3 68.3,82.4 68.3,87.4 68.3,92.5 68.3,97.6 68.3,102.7 68.3,107.7 68.3,112.8 68.3,117.8 68.3,122.8 24.5,22 24.5,30 24.5,38 24.5,46 24.5,54 24.5,62 62,86.5 57.7,35.9 54,29.8
  pour Top (rank 2): 3,0 arc-90 0,3 0,68 arc-90 3,71 19.5,71 arc90 48.5,100 arc90 19.5,129 19.5,133.5 arc-90 20.5,134.5 23,134.5 arc90 24,135.5 24,137.5 arc-90 25,138.5 31,138.5 arc-90 32,137.5 32,135.5 arc90 33,134.5 53,134.5 arc90 54,135.5 54,164 arc-90 57,167 99.5,167 arc-90 102.5,164 102.5,3 arc-90 99.5,0
  pour Bottom (rank 2): 3,0 arc-90 0,3 0,68 arc-90 3,71 19.5,71 arc90 48.5,100 arc90 19.5,129 19.5,133.5 arc-90 20.5,134.5 23,134.5 arc90 24,135.5 24,137.5 arc-90 25,138.5 31,138.5 arc-90 32,137.5 32,135.5 arc90 33,134.5 53,134.5 arc90 54,135.5 54,164 arc-90 57,167 99.5,167 arc-90 102.5,164 102.5,3 arc-90 99.5,0
MCU_N  (via drill 0.5)
  Top 0.508: U1.6 75.11,37.8 v75.2,37.9
  Bottom 0.508: PI-HABERLEŞME.2 9.36,51.35 35.35,51.35 36.21,52.21 61.29,52.21 75.2,38.3 v75.2,37.9
MCU_P  (via drill 0.5)
  Top 0.508: U1.5 73.83,37.87 v73.8,37.9
  Bottom 0.508: PI-HABERLEŞME.3 9.36,50.65 35.65,50.65 36.5,51.5 61,51.5 63.3,49.2 arc-90 63.3,48.49 63.21,48.4 arc90 63.21,47.68 67.86,43.03 arc90 68.58,43.03 68.67,43.12 arc-90 69.38,43.12 73.8,38.7 v73.8,37.9
MCU_RX  (via drill 0.5)
  Top 0.508: v57,46.1 SJ3.2 | SJ1.2 v67,24.3 | v61.2,32.3 60.1,31.2 U4.30
  Bottom 0.508: v67,24.3 66.6,24.3 60.9,30 60.9,32 v61.2,32.3 61.2,41.9 v57,46.1
MCU_TX  (via drill 0.5)
  Top 0.508: v59.8,32.3 59.5,32 U4.31 | v54.5,46.1 SJ4.1 | SJ2.1 v69.5,24.3
  Bottom 0.508: v69.5,24.3 68.5,23.3 66.5,23.3 60,29.8 60,32.1 v59.8,32.3 59.8,40.8 v54.5,46.1
MISO  (via drill 0.5)
  Top 0.508: v48.1,26.4 48.9,27.2 U4.16
  Bottom 0.508: v48.1,26.4 45.8,26.4 45.1,25.7 44.37,25.7 ICSP.3
MOSI  (via drill 0.5)
  Top 0.508: U4.15 48.3,28 v48.1,27.8
  Bottom 0.508: v48.1,27.8 44.81,27.8 ICSP.2
N$1  (via drill 0.5)
  Top 0.508: R5.2 v49,18.6
  Bottom 0.508: NEO-PIXEL.3 90,29 75.7,14.7 52.9,14.7 v49,18.6
N$2  (via drill 0.5)
  Top 0.508: R6.2 v51.5,18.6
  Bottom 0.508: NEO-PIXEL.4 91.38,34.08 88.6,31.3 88.6,28.7 75.4,15.5 53.3,15.5 51.5,17.3 v51.5,18.6
N$3
  Top 0.508: R7.2 88.5,37.55 90.11,39.16 NEO-PIXEL.5
N$4
  Top 0.508: L1.A 82.1,73.95 R30.1
N$5
  Top 0.508: R30.2 R31.1 C1.2 76.64,76.31 OC1.2
N$6
  Top 0.508: L9.A 82.1,114.45 R10.1
N$7
  Top 0.508: L1.C 92.17,76.05 BUTON.2
N$8
  Top 0.508: U2.3 68.64,63.87 68.1,64.4 56.52,64.4 55.92,63.8 54.82,63.8 BT1.1
N$9
  Top 0.508: U2.2 67.36,60.1 Y1.1
N$10
  Top 0.508: U2.1 66.09,60.16 Y1.2
N$11
  Top 0.508: L8.C 85.55,111.55 88.5,114.5 88.5,124.5 91.58,127.58 BOZUK_PARA.3
N$12
  Top 0.508: L2.A 82.1,79.02 R32.1
N$13
  Top 0.508: R32.2 R33.1 C2.2 76.64,81.38 OC2.2
N$14
  Top 0.508: R10.2 R11.1 C21.2 76.64,116.81 OC9.2
N$15
  Top 0.508: R3.2 RX.A
N$16
  Top 0.508: TX.A R29.2
N$17
  Top 0.508: R26.1 64.95,18.6 5V.A
N$19
  Top 0.508: R27.1 70.45,18.6 12V.A
N$20
  Top 0.508: U4.7 52,36.6 53.6,38.2 X2_5032.P$1 C14.1
N$21
  Top 0.508: U1.13 72.56,40.16 69.5,37.1 68.2,37.1 67.4,36.3 64.2,36.3 64,36.5 C8.1
N$22
  Top 0.508: U1.4 72.56,38.87 73.15,39.45 C26.1
N$24
  Top 0.508: L7.C 92.22,106.48 BUTON.8
N$25
  Top 0.508: L3.A 82.1,84.09 R34.1
N$26
  Top 0.508: R34.2 R35.1 C3.2 76.64,86.45 OC3.2
N$27
  Top 0.508: L9.C 85.55,116.55 86.5,117.5 86.5,144 91.54,149.04 YEDEK_BUTON.3
N$28
  Top 0.508: L6.C 92.21,101.41 BUTON.7
N$29
  Top 0.508: L4.A 82.1,89.16 R36.1
N$30
  Top 0.508: R36.2 R37.1 C4.2 76.64,91.52 OC4.2
N$31
  Top 0.508: L10.A 82.1,119.45 R12.1
N$32
  Top 0.508: L5.C 92.2,96.34 BUTON.6
N$33
  Top 0.508: L5.A 82.1,94.24 R38.1
N$34
  Top 0.508: R38.2 R39.1 C10.2 76.64,96.59 OC5.2
N$35
  Top 0.508: R12.2 R13.1 C22.2 76.64,121.81 OC10.2
N$36
  Top 0.508: L4.C 92.2,91.26 BUTON.5
N$37
  Top 0.508: L6.A 82.1,99.31 R40.1
N$38
  Top 0.508: R40.2 R41.1 C11.2 76.64,101.66 OC6.2
N$39
  Top 0.508: L10.C 84.5,147 91.62,154.12 YEDEK_BUTON.4
N$40
  Top 0.508: L3.C 92.19,86.19 BUTON.4
N$41
  Top 0.508: L7.A 82.1,104.38 R42.1
N$42
  Top 0.508: R42.2 R43.1 C12.2 76.64,106.73 OC7.2
N$44
  Top 0.508: L2.C 92.18,81.12 BUTON.3
N$45
  Top 0.508: L8.A 82.1,109.45 R44.1
N$46
  Top 0.508: R44.2 R45.1 C13.2 76.64,111.81 OC8.2
N$49
  Top 0.508: U1.7 76.38,33.67 74.8,32.1 X1_5032.P$1 C24.1
N$50
  Top 0.508: U1.8 77.64,33.26 78.8,32.1 X1_5032.P$2 C25.1
N$52
  Top 0.508: R19.1 68.25,34.2 69.5,34.2 70.03,34.73 U1.2
N$53
  Top 0.508: R54.1 71.3,34.74 U1.3
N$55
  Top 0.508: R1.1 42.95,38.6 BLINK.A
N$58
  Top 0.508: U4.20 53.6,24.15 54.3,23.45 55.3,23.45 56.8,21.95 C7.1
N$78
  Top 0.508: U4.8 51.2,36.6 49.6,38.2 X2_5032.P$2 C15.1
NEOPX_S1
  Top 0.508: R5.1 48.7,21.95 46.38,24.27 46.38,28.58 47.4,29.6 U4.13
NEOPX_S2
  Top 0.508: R6.1 51.45,21.95 49.85,23.55 48.1,23.55 47.11,24.54 47.11,28.21 47.7,28.8 U4.14
NEOPX_S3  (via drill 0.5)
  Top 0.508: v82.2,41 R7.1
  Bottom 0.508: U$3.12 59.23,91.07 60.4,89.9 60.4,59.9 76.3,44 79.2,44 v82.2,41
PI_RX
  Top 0.508: SJ4.2 54.7,49.26 55.3,49.86 55.3,57.7 48,65 48,86 51.8,89.8 56.5,89.8 U$3.10
PI_TX
  Top 0.508: SJ3.1 56.8,49.26 56.2,49.86 56.2,57.9 48.8,65.3 48.8,85.6 50.5,87.3 56.46,87.3 U$3.8
RESET  (via drill 0.5)
  Top 0.508: C8.2 R4.1 61.5,33.65 62.2,32.95 62.2,31.7 60.9,30.4 U4.29 56.7,30.4 v56.4,30.1
  Bottom 0.508: ICSP.5 49.99,20.69 56.4,27.1 v56.4,30.1
SCK  (via drill 0.5)
  Top 0.508: U4.17 49.8,25.87 48.93,25 v48.1,25
  Bottom 0.508: ICSP.4 45.23,23.23 47,25 v48.1,25
SCL  (via drill 0.5)
  Top 0.508: R8.1 54.28,82.5 U$3.5 | U2.6 68.64,68.7 68.14,69.2 54.4,69.2 51.8,71.8 v51.8,78
  Bottom 0.508: v51.8,78 51.8,80.02 U$3.5
SDA
  Top 0.508: U$3.3 54.32,80 R9.1 52.95,79.5 52.95,71.85 54.8,70 68.64,70 69.94,68.69 69.94,67.46 U2.5
SERVO_1P
  Top 0.508: U4.23 56,24.9 56.9,24 58,24 59,23 59,19 55.92,15.92 33.92,15.92 29.38,11.38 SERVO-ÇIKIŞ.3
SERVO_2P
  Top 0.508: SERVO-ÇIKIŞ.4 34.46,11.46 38.21,15.21 56.21,15.21 59.71,18.71 59.71,23.29 57.43,25.57 56.8,25.57 U4.24
SERVO_3P
  Top 0.508: SERVO-ÇIKIŞ.5 39.54,11.54 42.5,14.5 56.5,14.5 60.42,18.41 60.42,25.88 59.1,27.2 U4.25
SERVO_4P
  Top 0.508: SERVO-ÇIKIŞ.6 44.62,11.62 46.71,13.71 56.71,13.71 61.12,18.12 61.12,26.18 59.3,28 U4.26
SERVO_5P
  Top 0.508: SERVO-ÇIKIŞ.7 49.7,11.7 51,13 57.01,13 61.83,17.83 61.83,26.47 59.5,28.8 U4.27
SERVO_6P
  Top 0.508: U4.28 59.7,29.6 62.54,26.76 62.54,17.53 56.31,11.3 55.4,11.3 54.78,10.68 SERVO-ÇIKIŞ.8
V_PI  (via drill 0.5)
  Top 0.508: R8.2 R9.2 50.55,69.45 52.58,67.42 v64.8,67.42 U2.8 66.09,66.31 66.8,65.6 71.6,65.6 C5.1 | U$3.4 60.4,78.28 60.4,75.4 v64.8,71
  Bottom 0.508: v64.8,71 v64.8,67.42

### Text on the board
tPlace: Bilmatik V5.6 / Model 5 & + (Plus)
tNames: Rz2 | Rz1 | GND | FAN 12V | JP | GND | 12V | GPIO | C | A | SDJ | Ödül | %50 | D | B | GND | GND | 12V | 5V | NEO-2 | PWM | NE0-1 | GND | 12V | 5V | GND | M1 | M2 | M3 | M4 | M5 | M6 | 5V | 12V | GND | GÜÇ-ÇIKIŞI